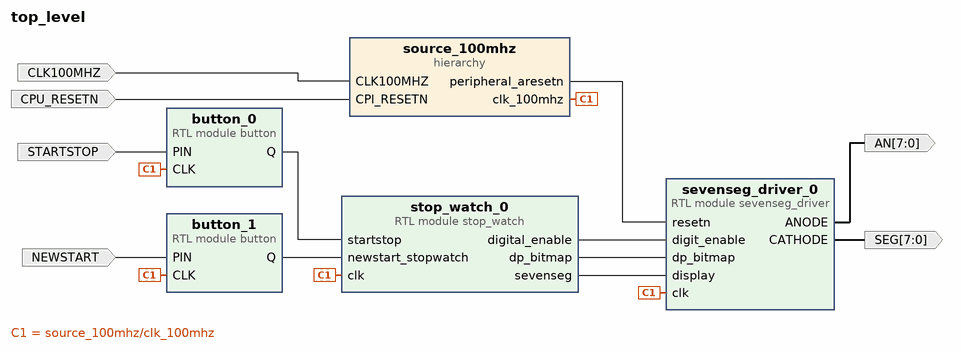
[diagram p0: block diagram of the top level]
# Vivado block design top_level, xc7a100tcsg324-1, Vivado 2021.1.1
create_bd_design top_level

create_bd_port -dir I -type clk CLK100MHZ
create_bd_port -dir I -type rst CPU_RESETN
create_bd_port -dir I STARTSTOP
create_bd_port -dir I NEWSTART
create_bd_port -dir O -from 7 -to 0 AN
create_bd_port -dir O -from 7 -to 0 SEG

create_bd_cell -type module -reference button button_0
create_bd_cell -type hier source_100mhz
create_bd_cell -type module -reference button button_1
create_bd_cell -type module -reference sevenseg_driver sevenseg_driver_0
create_bd_cell -type module -reference stop_watch stop_watch_0

# ---- hierarchy /source_100mhz ----
current_bd_instance /source_100mhz
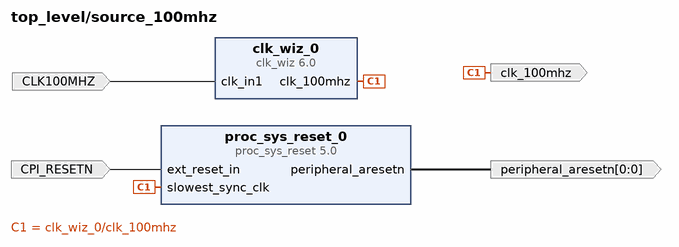
[diagram p1: block diagram inside /source_100mhz]
create_bd_pin -dir O -type clk clk_100mhz
create_bd_pin -dir I -type rst CPI_RESETN
create_bd_pin -dir O -from 0 -to 0 -type rst peripheral_aresetn
create_bd_pin -dir I -type clk CLK100MHZ

create_bd_cell -type ip -vlnv xilinx.com:ip:proc_sys_reset:5.0 proc_sys_reset_0
create_bd_cell -type ip -vlnv xilinx.com:ip:clk_wiz:6.0 clk_wiz_0
set_property -dict {CONFIG.CLK_OUT1_PORT clk_100mhz CONFIG.USE_LOCKED false CONFIG.USE_RESET false} [get_bd_cells clk_wiz_0]

# ---- connections ----

current_bd_instance /source_100mhz
connect_bd_net -net clk_in1_0_1 [get_bd_pins CLK100MHZ] [get_bd_pins clk_wiz_0/clk_in1]
connect_bd_net [get_bd_pins clk_wiz_0/clk_100mhz] [get_bd_pins clk_100mhz] [get_bd_pins proc_sys_reset_0/slowest_sync_clk]
connect_bd_net -net ext_reset_in_0_1 [get_bd_pins CPI_RESETN] [get_bd_pins proc_sys_reset_0/ext_reset_in]
connect_bd_net [get_bd_pins proc_sys_reset_0/peripheral_aresetn] [get_bd_pins peripheral_aresetn]

current_bd_instance /
connect_bd_net -net PIN_0_1 [get_bd_ports STARTSTOP] [get_bd_pins button_0/PIN]
connect_bd_net -net PIN_0_2 [get_bd_ports NEWSTART] [get_bd_pins button_1/PIN]
connect_bd_net [get_bd_pins button_0/Q] [get_bd_pins stop_watch_0/startstop]
connect_bd_net [get_bd_pins button_1/Q] [get_bd_pins stop_watch_0/newstart_stopwatch]
connect_bd_net -net clk_in1_0_1 [get_bd_ports CLK100MHZ] [get_bd_pins source_100mhz/CLK100MHZ]
connect_bd_net -net clk_wiz_0_clk_100mhz [get_bd_pins source_100mhz/clk_100mhz] \
  [get_bd_pins button_0/CLK] [get_bd_pins button_1/CLK] [get_bd_pins sevenseg_driver_0/clk] [get_bd_pins stop_watch_0/clk]
connect_bd_net -net ext_reset_in_0_1 [get_bd_ports CPU_RESETN] [get_bd_pins source_100mhz/CPI_RESETN]
connect_bd_net -net proc_sys_reset_0_peripheral_aresetn [get_bd_pins source_100mhz/peripheral_aresetn] [get_bd_pins sevenseg_driver_0/resetn]
connect_bd_net [get_bd_pins sevenseg_driver_0/ANODE] [get_bd_ports AN]
connect_bd_net [get_bd_pins sevenseg_driver_0/CATHODE] [get_bd_ports SEG]
connect_bd_net [get_bd_pins stop_watch_0/digital_enable] [get_bd_pins sevenseg_driver_0/digit_enable]
connect_bd_net [get_bd_pins stop_watch_0/dp_bitmap] [get_bd_pins sevenseg_driver_0/dp_bitmap]
connect_bd_net [get_bd_pins stop_watch_0/sevenseg] [get_bd_pins sevenseg_driver_0/display]

validate_bd_design
save_bd_design
